# EasyEDA schematic 6-coils-red-v1.json
TITLE: Sheet_1; REV: 1.0; Date: 2024-01-02; Sheet: 1/1; Company: Your Company
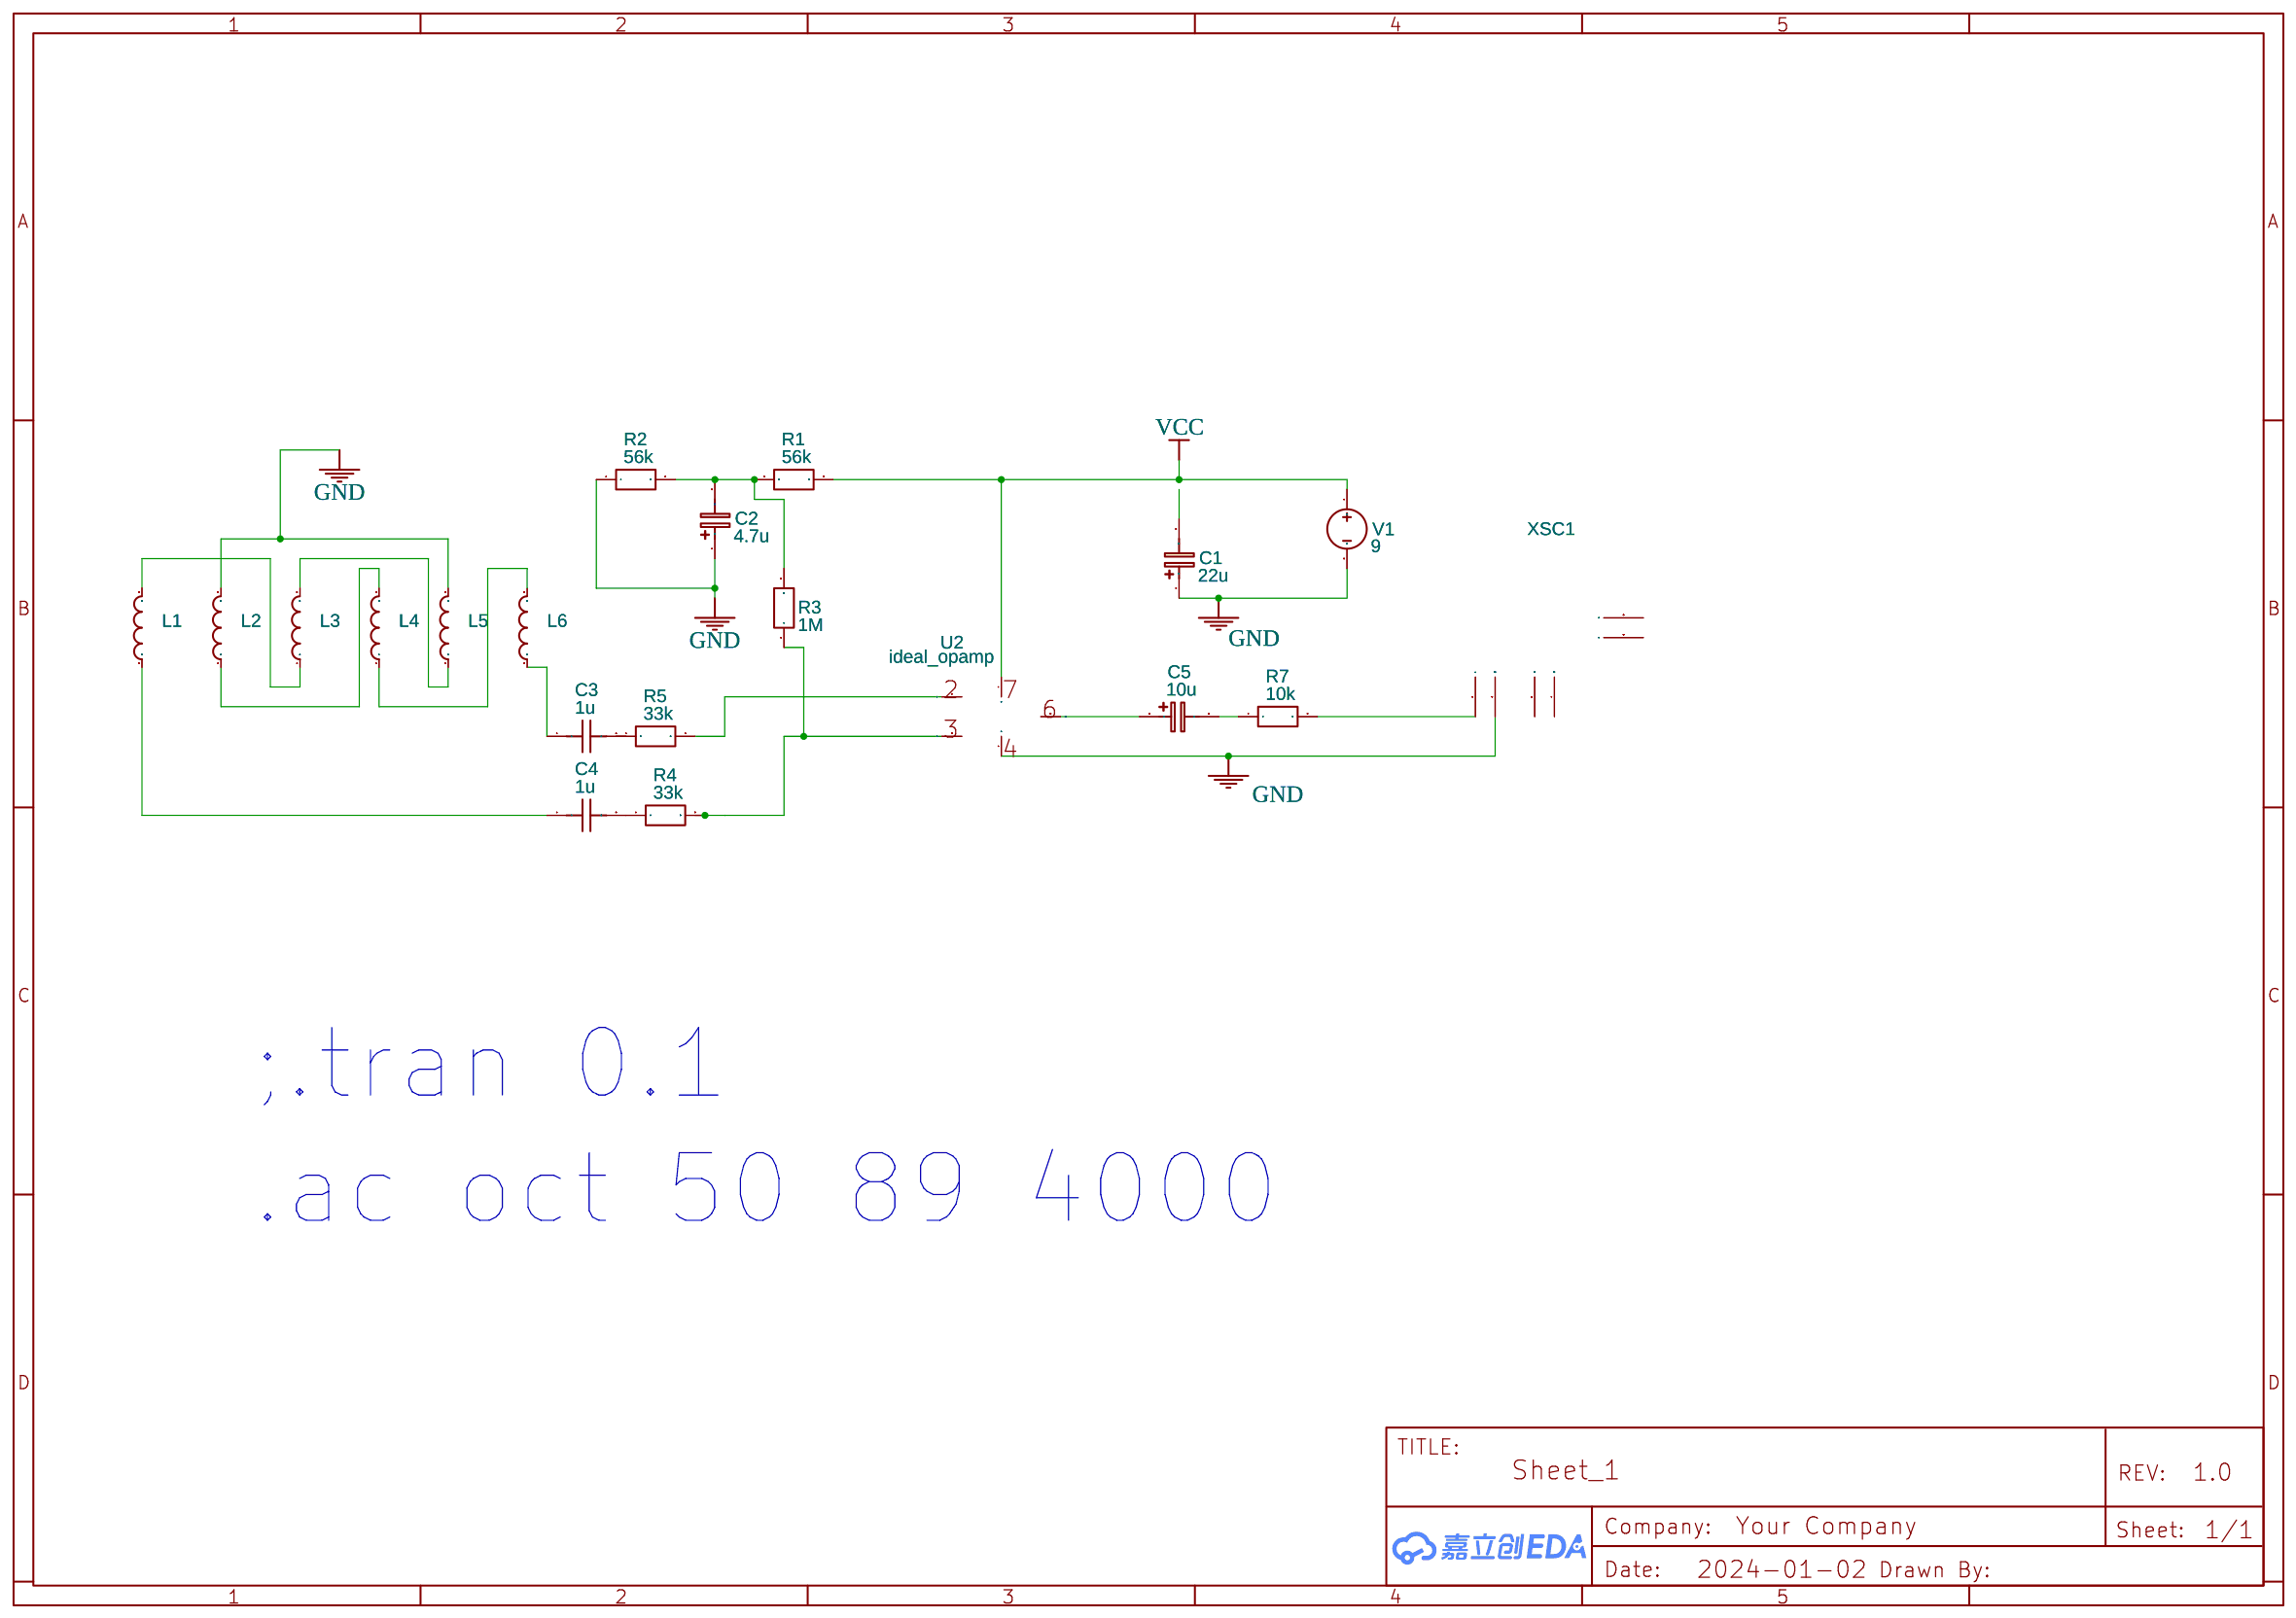
[diagram p0: schematic sheet]

## Parts
C1  22u  [SMD]
C2  4.7u  [SMD]
C3  1u  [C0603]
C4  1u  [C0603]
C5  10u  [SMD]
L1  INDUCTOR_SMD:L_COILCRAFT_XXL4040  [IND-SMD_L4.0-W4.0]
L2  INDUCTOR_SMD:L_COILCRAFT_XXL4040  [IND-SMD_L4.0-W4.0]
L3  INDUCTOR_SMD:L_COILCRAFT_XXL4040  [IND-SMD_L4.0-W4.0]
L4  INDUCTOR_SMD:L_COILCRAFT_XXL4040  [IND-SMD_L4.0-W4.0]
L5  INDUCTOR_SMD:L_COILCRAFT_XXL4040  [IND-SMD_L4.0-W4.0]
L6  INDUCTOR_SMD:L_COILCRAFT_XXL4040  [IND-SMD_L4.0-W4.0]
R1  56k  [R0603]
R2  56k  [R0603]
R3  1M  [R0603]
R4  33k  [R0603]
R5  33k  [R0603]
R7  10k  [R0603]
U2  ideal_opamp  [LM741CN-DIP-8]
V1  9  [HDR1X2]
XSC1  Oscilloscope

## Library data of the parts
C1 C2 C5 = C_Tan_SMD_A_EU: Contributor: LCEDA_Lib
C3 C4 = C_0603_US: Contributor: LCEDA_Lib
L1-L6 = INDUCTOR_SMD:L_COILCRAFT_XXL4040: Contributor: LCSC; Supplier: LCSC; Supplier Part: C9900003196; Manufacturer: null; JLCPCB Part Class: Extended Part
R1-R5 R7 = R_0603_EU: Contributor: LCEDA_Lib
U2 = LM741: Contributor: juan_g2; sim: true
V1 = VDC: Contributor: EasyEDA; sim: true
XSC1 = OSCILLOSCOPE: Contributor: EasyEDA; NameDisplay: 0; sim: true

## Nets
GND: C1.1 C2.1 L2.2 L5.2 R2.1 U2.4(V-) V1.2 XSC1.2(GND1)
VCC: R1.2 U2.7(V+) V1.1
Net-(C2-2): C2.2 R1.1 R2.2 R3.2
Net-(C3-1): C3.1 L6.1
Net-(C4-1): C4.1 L1.1
Net-(C4-2): C4.2 R4.1
Net-(C5-1): C5.1 U2.6(OUT)
Net-(C5-2): C5.2 R7.1
Net-(L1-2): L1.2 L3.1
Net-(L2-1): L2.1 L4.2
Net-(L3-2): L3.2 L5.1
Net-(L4-1): L4.1 L6.2
Net-(R3-1): R3.1 R4.2 U2.3(IN+)
Net-(R5-2): R5.2 U2.2(IN-)
Net-(R7-2): R7.2 XSC1.1(A)

Not connected (* = marked no-connect by the designer): C1 2; C3 2; R5 1; XSC1 3(B) 4(GND2) 5(T+) 6(T-)

## Notes on the sheet
- ;.tran 0.1
- .ac oct 50 89 4000
